# EAGLE schematic arduino-breakout (EAGLE 5.01)
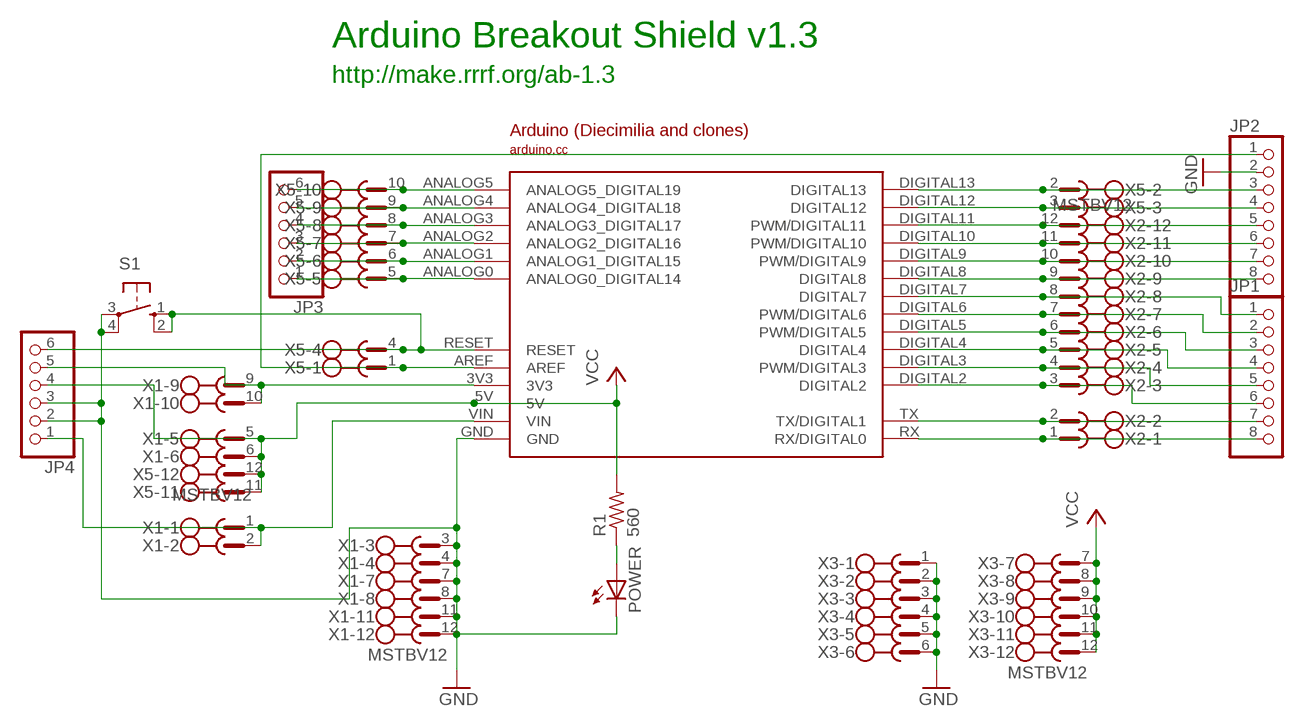
[diagram p0: schematic, sheet 1]

## Parts
JP1  PINHD-1X8  [1X08]
JP2  PINHD-1X8  [1X08]
JP3  PINHD-1X6  [1X06]
JP4  PINHD-1X6  [1X06]
POWER  LED5MM  [LED5MM]
R1  560  R-US_0207/7  [0207/7]
S1  10-XX  [B3F-10XX]
U$1  ARDUINODIECIMILIA  [ARDUINO]
X1  MSTBV12  [MSTBV12]
X2  MSTBV12  [MSTBV12]
X3  MSTBV12  [MSTBV12]
X5  MSTBV12  [MSTBV12]

## Nets
GND: JP2.2 JP4.2 JP4.3 POWER.K(C) S1.3(P) S1.4(P1) U$1.GND X1.3 X1.4 X1.7 X1.8 X1.11 X1.12 X3.1 X3.2 X3.3 X3.4 X3.5 X3.6
N$1: JP1.8 U$1.RX(RX/DIGITAL0) X2.1
N$2: JP1.7 U$1.TX(TX/DIGITAL1) X2.2
N$3: JP1.6 U$1.DIGITAL2 X2.3
N$4: JP1.5 U$1.DIGITAL3(PWM/DIGITAL3) X2.4
N$5: JP1.4 U$1.DIGITAL4 X2.5
N$6: JP1.3 U$1.DIGITAL5(PWM/DIGITAL5) X2.6
N$7: JP1.2 U$1.DIGITAL6(PWM/DIGITAL6) X2.7
N$8: JP1.1 U$1.DIGITAL7 X2.8
N$9: JP2.8 U$1.DIGITAL8 X2.9
N$10: JP2.7 U$1.DIGITAL9(PWM/DIGITAL9) X2.10
N$11: JP2.6 U$1.DIGITAL10(PWM/DIGITAL10) X2.11
N$12: JP2.5 U$1.DIGITAL11(PWM/DIGITAL11) X2.12
N$13: JP2.4 U$1.DIGITAL12 X5.3
N$14: JP2.3 U$1.DIGITAL13 X5.2
N$15: JP4.6 S1.1(S) S1.2(S1) U$1.RESET X5.4
N$16: POWER.A R1.1
N$17: JP3.6 U$1.ANALOG5(ANALOG5_DIGITAL19) X5.10
N$18: JP3.5 U$1.ANALOG4(ANALOG4_DIGITAL18) X5.9
N$19: JP3.4 U$1.ANALOG3(ANALOG3_DIGITAL17) X5.8
N$20: JP3.3 U$1.ANALOG2(ANALOG2_DIGITAL16) X5.7
N$21: JP3.2 U$1.ANALOG1(ANALOG1_DIGITAL15) X5.6
N$22: JP3.1 U$1.ANALOG0(ANALOG0_DIGITAL14) X5.5
N$23: JP2.1 U$1.AREF X5.1
N$26: JP4.5 U$1.3V3 X1.9 X1.10
N$28: JP4.1 U$1.VIN X1.1 X1.2
VCC: JP4.4 R1.2 U$1.5V X1.5 X1.6 X3.7 X3.8 X3.9 X3.10 X3.11 X3.12 X5.11 X5.12

## Notes on the sheet
- Arduino Breakout Shield v1.3
- http://make.rrrf.org/ab-1.3

## Library data of the parts
JP1 JP2 = pinhead:PINHD-1X8: PIN HEADER
JP3 JP4 = pinhead:PINHD-1X6: PIN HEADER
POWER = led:LED: LED OSRAM: - CHIPLED LG R971, LG N971, LY N971, LG Q971, LY Q971, LO R971, LY R971 LH N974, LH R974 LS Q976, LO Q976, LY Q976 LO Q996 - Hyper CHIPLED LW Q18S LB Q993, LB Q99A, LB R99A - SideLED LS A670, LO A670, LY A670, LG A670, LP A670 LB A673, LV A673, LT A673, LW A673 LH A674 LY A675 LS A676, LA A676, LO A676, LY A676, LW A676 LS A679, LY A679, LG A679 - Hyper Micro SIDELED® LS Y876, LA Y876, LO Y876, LY Y876 LT Y87S - SmartLED LW L88C, LW L88S LB L89C, LB L89S, LG L890 LS L89K, LO L89K, LY L89K LS L896, LA L896, LO L896, LY L896 - TOPLED LS T670, LO T670, LY T670, LG T670, LP T670 LSG T670, LSP T670, LSY T670, LOP T670, LYG T670 LG T671, LOG T671, LSG T671 LB T673, LV T673, LT T673, LW T673 LH T674 LS T676, LA T676, LO T676, LY T676, LB T676, LH T676, LSB T676, LW T676 LB T67C, LV T67C, LT T67C, LS T67K, LO T67K, LY T67K, LW E67C LS E67B, LA E67B, LO E67B, LY E67B, LB E67C, LV E67C, LT E67C LW T67C LS T679, LY T679, LG T679 LS T770, LO T770, LY T770, LG T770, LP T770 LB T773, LV T773, LT T773, LW T773 LH T774 LS E675, LA E675, LY E675, LS T675 LS T776, LA T776, LO T776, LY T776, LB T776 LHGB T686 LT T68C, LB T68C - Hyper Mini TOPLED® LB M676 - Mini TOPLED Santana® LG M470 LS M47K, LO M47K, LY M47K Source: http://www.osram.convergy.de - LUMILED® LXK2-PW12-R00, LXK2-PW12-S00, LXK2-PW14-U00, LXK2-PW14-V00 LXK2-PM12-R00, LXK2-PM12-S00, LXK2-PM14-U00 LXK2-PE12-Q00, LXK2-PE12-R00, LXK2-PE12-S00, LXK2-PE14-T00, LXK2-PE14-U00 LXK2-PB12-K00, LXK2-PB12-L00, LXK2-PB12-M00, LXK2-PB14-N00, LXK2-PB14-P00, LXK2-PB14-Q00 LXK2-PR12-L00, LXK2-PR12-M00, LXK2-PR14-Q00, LXK2-PR14-R00 LXK2-PD12-Q00, LXK2-PD12-R00, LXK2-PD12-S00 LXK2-PH12-R00, LXK2-PH12-S00 LXK2-PL12-P00, LXK2-PL12-Q00, LXK2-PL12-R00 Source: www.luxeon.com
R1 = rcl:R-US_: RESISTOR, American symbol
S1 = switch-omron:10-XX: OMRON SWITCH
U$1 = reprap:ARDUINO
X1-X3 X5 = con-phoenix-508:MSTBV12: PHOENIX

## Net classes
0 default: width 0.508 mm, clearance 0.406 mm